# EAGLE design Canzasi-Prot (EAGLE 7.6.0)
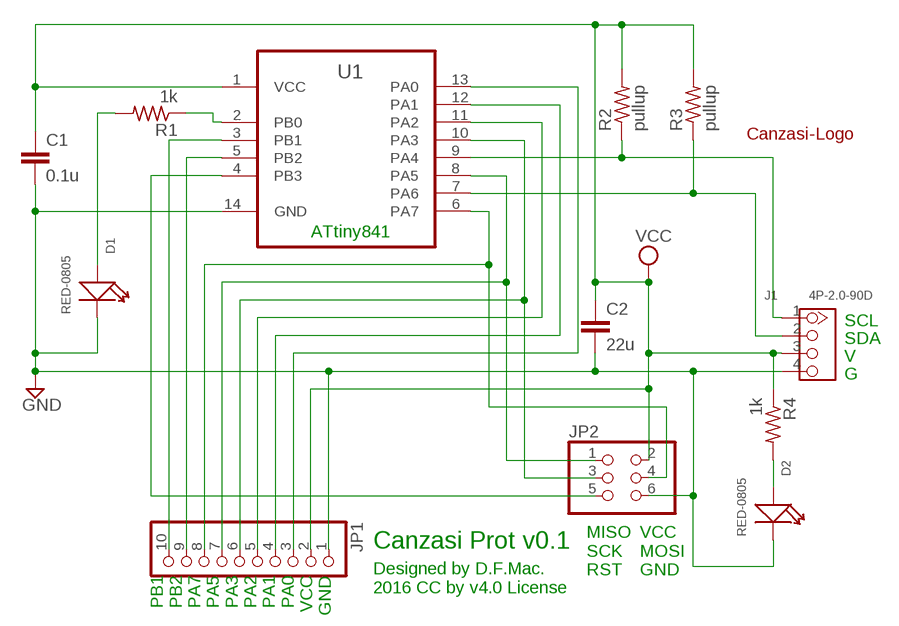
[diagram p0: schematic, sheet 1]

## Parts
C1  0.1u  C-EUC0603  [C0603]
C2  22u  C-EUC0805  [C0805]
D1  RED-0805  SMD-LED-CLEAR-RED(0805)  [LED-0805]
D2  RED-0805  SMD-LED-CLEAR-RED(0805)  [LED-0805]
J1  4P-2.0-90D  GROVE-CONNECTOR-DIP-90D(4P-2.0)  [HW4-2.0-90D]
JP1  PINHD-1X10  [1X10]
JP2  PINHD-2X3  [2X03]
R1  1k  R-US_R0603  [R0603]
R2  pullup  R-US_R0603  [R0603]
R3  pullup  R-US_R0603  [R0603]
R4  1k  R-US_R0603  [R0603]
U1  ATTINY44A-SSU  [SOIC127P600X175-14N]
U$1  CANZASI-LOGOMEDIUM  [CANZASI-LOGO-MEDIUM]

## Nets
GND [GND]: C1.2 C2.2 D1.- D2.- J1.4 JP1.1 JP2.6 U1.14(GND)
N$1: R1.1 U1.2(PB0)
N$2: D1.+ R1.2
N$3: J1.2 R3.1 U1.7(PA6)
N$4: J1.1 R2.1 U1.9(PA4)
N$5: JP1.10 U1.3(PB1)
N$6: JP1.9 U1.5(PB2)
N$7: JP2.5 U1.4(PB3)
N$8: JP1.8 JP2.4 U1.6(PA7)
N$9: JP1.7 JP2.1 U1.8(PA5)
N$10: JP1.6 JP2.3 U1.10(PA3)
N$11: JP1.5 U1.11(PA2)
N$12: JP1.4 U1.12(PA1)
N$13: JP1.3 U1.13(PA0)
N$14: D2.+ R4.2
VCC [VCC]: C1.1 C2.1 J1.3 JP1.2 JP2.2 R2.2 R3.2 R4.1 U1.1(VCC)

## Notes on the sheet
- ATtiny841
- SCL
- SDA
- V
- G
- Canzasi Prot v0.1
- PB1
  PB2
  PA7
  PA5
  PA3
  PA2
  PA1
  PA0
  VCC
  GND
- MISO
  SCK
  RST
- VCC
  MOSI
  GND
- Designed by D.F.Mac.
  2016 CC by v4.0 License

## Library data of the parts
C1 C2 = 0my:C-EU: CAPACITOR, European symbol
D1 D2 = Seeed-OPL-Diode:SMD-LED-CLEAR-RED(0805): 304090046; MPN: 17-215SURC/S530-A2/TR8
J1 = Seeed-OPL-Connector:GROVE-CONNECTOR-DIP-90D(4P-2.0): 320110034
JP1 = 0my:PINHD-1X10: PIN HEADER
JP2 = 0my:PINHD-2X3: PIN HEADER
R1-R4 = 0my:R-US_: RESISTOR, American symbol
U1 = Atmel_By_element14_Batch_1-00:ATTINY44A-SSU: 8-bit Microcontroller with In-System Programmable Flash; MPN: ATTINY44A-SSU; OC_FARNELL: 1699397; OC_NEWARK: 80P3683; PACKAGE: SOIC-14; SUPPLIER: Atmel
U$1 = 1my:CANZASI-LOGO

## Net classes
0 default: width 0.33 mm, drill 0.178 mm, clearance 0.152 mm
1 VCC: width 0.508 mm, drill 0.178 mm, clearance 0.152 mm
2 GND: width 0.508 mm, drill 0.178 mm, clearance 0.152 mm

## Board
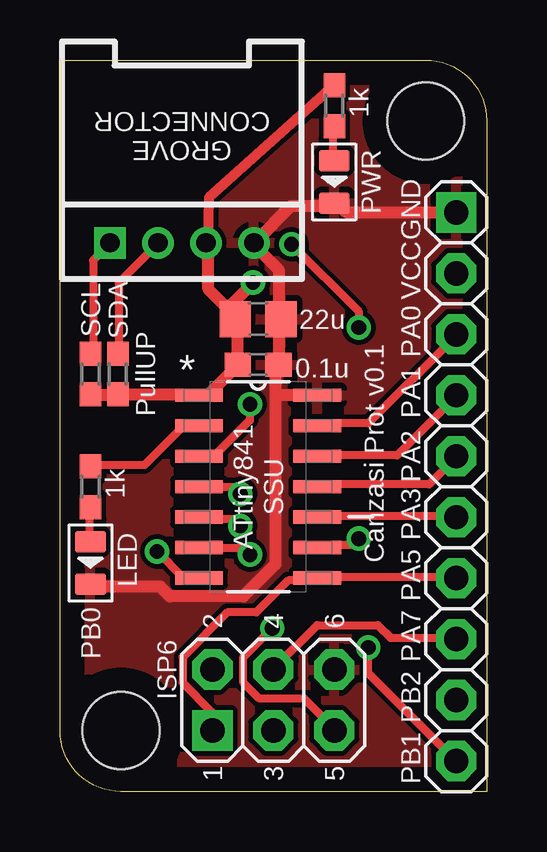
[diagram p1: board, top side]
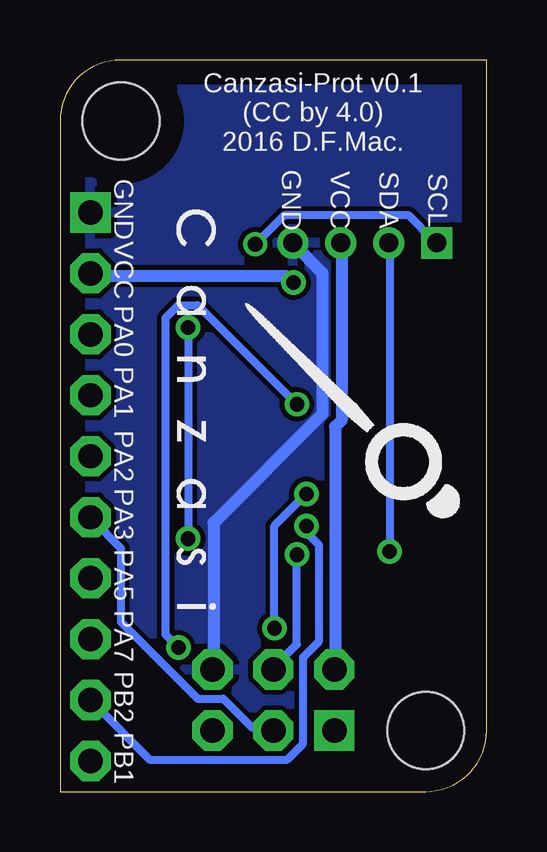
[diagram p2: board, bottom side, seen from below]

Size 17.78 x 30.48 mm. Coordinates in mm from the lower left corner, seen from the top.
Outline: 17.78,0 2.54,0 arc-90 0,2.54 0,30.48 15.24,30.48 arc-90 17.78,27.94 17.78,0
Copper layers (1*16): Top 0.035mm / dielectric 1.5mm / Bottom 0.035mm
Design rules "default": minimum track width 10mil, minimum drill 24mil, track to track 8mil, track to pad 8mil, pad to pad 8mil, via to via 8mil, smd to smd 8mil, copper to edge 40mil, drill to drill 8mil, minimum pad ring 10mil, minimum via ring 8mil, stop-mask expansion 4mil, vias tented up to drill 0mil, thermal gap 10mil
Holes 3.2 mm at 2.54,2.54 15.24,27.94

### Footprints (pad centres in the part's own frame; a part is rotated, then mirrored left to right if it is on the bottom)
C0603 = smd 1.1 x 1: 1 -0.85,0; 2 0.85,0
C0805 = smd 1.3 x 1.5: 1 -0.95,0; 2 0.95,0
LED-0805 = smd 0.889 x 1.27: + -0.889,0; - 0.889,0
HW4-2.0-90D = drill 0.8 pad 1.27 square: 1 -3,0 | drill 0.8 pad 1.27: 2 -1,0; 3 1,0; 4 3,0
1X10 = drill 1.016 pad 1.676 square: 1 -11.43,0 | drill 1.016 pad 1.676 octagon: 2 -8.89,0; 3 -6.35,0; 4 -3.81,0; 5 -1.27,0; 6 1.27,0; 7 3.81,0; 8 6.35,0; 9 8.89,0; 10 11.43,0
2X03 = drill 1.016 pad 1.676 square: 1 -2.54,-1.27 | drill 1.016 pad 1.676 octagon: 2 -2.54,1.27; 3 0,-1.27; 4 0,1.27; 5 2.54,-1.27; 6 2.54,1.27
R0603 = smd 1 x 0.9: 1 -0.85,0; 2 0.85,0
SOIC127P600X175-14N = smd 1.981 x 0.559: 1 -2.464,3.81; 2 -2.464,2.54; 3 -2.464,1.27; 4 -2.464,0; 5 -2.464,-1.27; 6 -2.464,-2.54; 7 -2.464,-3.81; 8 2.464,-3.81; 9 2.464,-2.54; 10 2.464,-1.27; 11 2.464,0; 12 2.464,1.27; 13 2.464,2.54; 14 2.464,3.81

### Placement (x,y rotation side)
C1  8.26,17.78 0 top
C2  8.26,19.68 0 top
D1  1.27,9.53 270 top
D2  11.43,25.4 270 top
J1  5.08,22.86 0 top
JP1  16.51,12.7 270 top
JP2  8.89,3.81 0 top
R1  1.27,12.7 270 top
R2  1.27,17.4 270 top
R3  2.41,17.4 270 top
R4  11.43,28.57 270 top
U1  8.26,12.7 0 top
U$1  13.72,25.02 270 bottom

### Tracks (layer width: path | path; a pad name or v marks a point on that pad's centre or on a via)
GND
  Top 0.508: 8.98,16.54 8.98,17.6 C1.2 9.11,17.87 9.11,19.6 C2.2 9.11,19.87 9.11,21.74 8.18,22.67 J1.4 8.18,22.94 9.65,24.4 11.38,24.4 D2.- 11.65,24.4 11.91,24.14 16.45,24.14 JP1.1 | 8.98,16.54 8.98,9.47 7.64,8.13 4.58,8.13 4.18,8.53 1.38,8.53 D1.- | 8.98,16.54 10.71,16.54 U1.14
  Bottom 0.508: JP2.6 11.38,5.2 11.38,11.2 6.84,15.73 6.84,21.6 8.04,22.8 J1.4
  pour Bottom: 0.64,29.84 17.14,29.84 17.14,0.64 0.64,0.64
  pour Top: 0,31.11 17.78,31.11 17.78,0 0,0
N$1
  Top 0.33: R1.1 1.38,13.6 3.51,13.6 5.11,15.2 5.78,15.2 U1.2
N$2
  Top 0.33: R1.2 1.25,11.73 1.25,10.54 D1.+
N$3  (via drill 0.61)
  Top 0.33: R3.1 2.44,18.27 2.44,21.2 4.04,22.8 J1.2 | v4.04,10 5.11,8.93 5.78,8.93 U1.7
  Bottom 0.33: v4.04,10 4.04,22.8 J1.2
N$4  (via drill 0.61)
  Top 0.33: R2.1 1.38,18.27 1.38,22.14 2.04,22.8 J1.1 | v12.45,10.54 12.18,10.27 10.85,10.27 U1.9 | v12.45,19.34 12.45,20 v9.65,22.8
  Bottom 0.33: v12.45,19.34 v12.45,10.54 | v9.65,22.8 8.45,24 3.25,24 2.18,22.94 J1.1
N$5  (via drill 0.61)
  Top 0.33: v7.91,16.14 7.91,15.47 6.45,14 5.91,14 U1.3 | v12.85,6 12.85,4.93 JP1.10
  Bottom 0.33: v7.91,16.14 12.05,20.27 12.85,20.27 13.38,19.74 13.38,6.53 v12.85,6
N$6  (via drill 0.61)
  Top 0.33: v7.51,11.07 7.25,11.34 5.91,11.34 U1.5
  Bottom 0.33: v7.51,11.07 7.51,10.8 6.98,10.27 6.98,6.27 7.64,5.6 7.64,2 8.31,1.33 14.05,1.33 16.45,3.73 JP1.9
N$7  (via drill 0.61)
  Top 0.33: v7.51,12.4 7.25,12.67 5.91,12.67 U1.4 | v8.85,6.8 7.64,5.6 7.64,4.53 8.31,3.87 10.18,3.87 11.38,2.67 JP2.5
  Bottom 0.33: v7.51,12.4 8.85,11.07 v8.85,6.8
N$8  (via drill 0.61)
  Top 0.33: v7.91,9.87 7.64,10.13 5.91,10.13 U1.6 | JP1.8 16.45,6.4 13.78,6.4 13.25,6.93 10.71,6.93 8.98,5.2 JP2.4
  Bottom 0.33: v7.91,9.87 7.91,6.13 8.85,5.2 JP2.4
N$9
  Top 0.33: JP1.7 16.45,8.93 10.85,8.93 U1.8 10.58,8.8 9.51,8.8 8.18,7.47 6.98,7.47 5.11,5.6 5.11,4.53 6.31,3.33 6.31,2.67 JP2.1
N$10
  Top 0.33: U1.10 10.85,11.47 16.45,11.47 JP1.6
  Bottom 0.33: JP2.3 8.98,2.67 9.78,2.67 10.98,3.87 12.05,3.87 15.25,7.07 15.25,10.13 16.45,11.34 JP1.6
N$11
  Top 0.33: U1.11 10.85,12.8 15.38,12.8 16.45,13.87 JP1.5
N$12
  Top 0.33: U1.12 10.85,14 14.05,14 16.45,16.4 JP1.4
N$13
  Top 0.33: U1.13 10.85,15.34 12.85,15.34 16.45,18.94 JP1.3
N$14
  Top 0.33: R4.2 11.38,27.6 11.38,26.4 D2.+
VCC  (via drill 0.61)
  Top 0.406: 6.18,22.8 6.22,24.77 R4.1
  Top 0.508: C2.1 7.38,19.6 7.38,17.87 C1.1 7.25,17.6 6.18,16.54 6.04,16.54 U1.1 5.78,16.54 2.58,16.54 R3.2 2.31,16.54 1.38,16.54 R2.2 | J1.3 6.18,22.8 6.18,20.94 7.25,19.87 C2.1 | v8.04,21.2 7.11,20.27 C2.1
  Bottom 0.508: v8.04,21.2 8.31,21.47 16.45,21.47 JP1.2 | JP2.2 6.31,5.2 6.31,15.2 6.04,15.47 6.04,22.8 J1.3

### Text on the board
tNames: 1k | GROVE / CONNECTOR | PWR | GND | VCC | SCL | SDA | 22u | PA0 | 0.1u | PullUP | PA1 | Canzasi Prot v0.1 | PA2 | 1k | ATtiny841 | SSU | PA3 | LED | PA5 | PB0 | 2 | 4 | 6 | PA7 | ISP6 | PB2 | 1 | 3 | 5 | PB1
bNames: Canzasi-Prot v0.1 / (CC by 4.0) / 2016 D.F.Mac. | SCL | SDA | VCC | GND | GND | VCC | PA0 | PA1 | PA2 | PA3 | PA5 | PA7 | PB2 | PB1